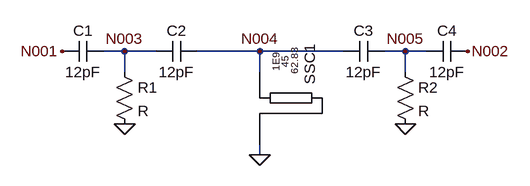
[diagram p0: schematic Draft2.asc]
Draft2.asc, the LTspice schematic file:
Version 4
SHEET 1 880 680
WIRE 64 80 32 80
WIRE 112 80 64 80
WIRE 272 80 176 80
WIRE 400 80 272 80
WIRE 496 80 464 80
WIRE 528 80 496 80
WIRE 64 112 64 80
WIRE 272 112 272 80
WIRE 496 112 496 80
WIRE 272 240 272 224
FLAG 64 192 0
FLAG 272 240 0
FLAG 496 192 0
FLAG -32 80 N001
FLAG 592 80 N002
FLAG 64 80 N003
FLAG 272 80 N004
FLAG 496 80 N005
SYMBOL cap 32 64 R90
WINDOW 0 0 32 VBottom 2
WINDOW 3 32 32 VTop 2
SYMATTR InstName C1
SYMATTR Value 12pF
SYMBOL cap 176 64 R90
WINDOW 0 0 32 VBottom 2
WINDOW 3 32 32 VTop 2
SYMATTR InstName C2
SYMATTR Value 12pF
SYMBOL cap 592 64 R90
WINDOW 0 0 32 VBottom 2
WINDOW 3 32 32 VTop 2
SYMATTR InstName C4
SYMATTR Value 12pF
SYMBOL cap 464 64 R90
WINDOW 0 0 32 VBottom 2
WINDOW 3 32 32 VTop 2
SYMATTR InstName C3
SYMATTR Value 12pF
SYMBOL res 48 96 R0
SYMATTR InstName R1
SYMBOL res 480 96 R0
SYMATTR InstName R2
SYMBOL SSC 320 176 R90
SYMATTR SpiceModel 62.83
SYMATTR Value 45
SYMATTR Value2 1E9
SYMATTR InstName SSC1

The netlist it stands for:
* Draft2.asc
C1 N003 N001 12pF
C2 N004 N003 12pF
C4 N002 N005 12pF
C3 N005 N004 12pF
R1 N003 0 R
R2 N005 0 R
SSC1 N004 0 62.83 45 1E9
.backanno
.end